# EAGLE design zigbee-dimmer2 (EAGLE 7.7.0)
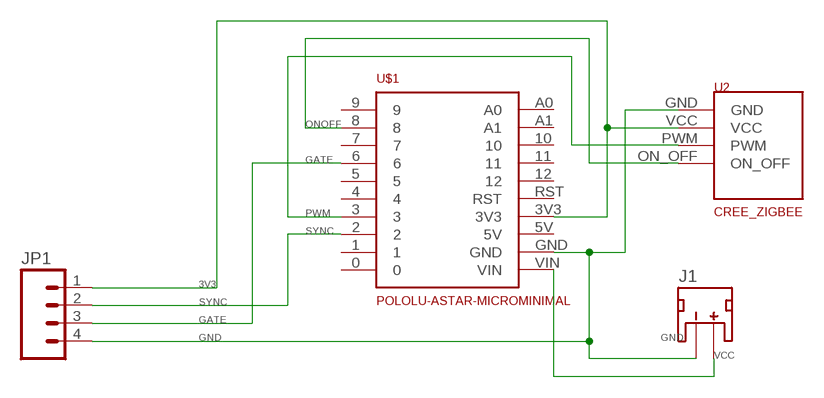
[diagram p0: schematic, sheet 1]

## Parts
J1  JST_2MM_MALE  [JST-2-SMD]
JP1  DIMMER_PINSSMD_180  [1X04-SMD]
U2  CREE_ZIGBEE  [CREE-ZIGBEE]
U$1  POLOLU-ASTAR-MICROMINIMAL  [POLOLU-ASTAR_MICRO_MIN]

## Nets
3V3: JP1.1 U2.VCC U$1.3V3
GATE: JP1.3 U$1.6
GND: J1.1(-) JP1.4 U2.GND U$1.GND
ONOFF: U2.ON_OFF U$1.8
PWM: U2.PWM U$1.3
SYNC: JP1.2 U$1.2
VCC: J1.2(+) U$1.VIN
Unconnected: J1.NC1(PAD1) J1.NC2(PAD2) U$1.0 U$1.1 U$1.4 U$1.5 U$1.7 U$1.9 U$1.10 U$1.11 U$1.12 U$1.A0 U$1.A1 U$1.RST

## Power pins joined to a net without a drawn wire
5V: U$1.5V

## Library data of the parts
J1 = SparkFun-Connectors:JST_2MM_MALE: Mates to single-cell LiPo batteries. CONN-11443 Now with smashable polarity marks!; BTM_NEG: -; BTM_POS: +; PROD_ID: CONN-11443; TOP_NEG: -; TOP_POS: +
JP1 = zigbee-dimmer-libs:DIMMER_PINS: Header 4 Standard 4-pin 0.1" header. Use with straight break away headers (SKU : PRT-00116), right angle break away headers (PRT-00553), swiss pins (PRT-00743), machine pins (PRT-00117), and female headers (PRT-00115). Molex polarized connector foot print use with SKU : PRT-08231 with associated crimp pins and housings. 1MM SMD Version SKU: PRT-10208
U2 = zigbee-dimmer-libs:CREE_ZIGBEE
U$1 = zigbee-dimmer-libs:POLOLU-ASTAR-MICRO

## Board
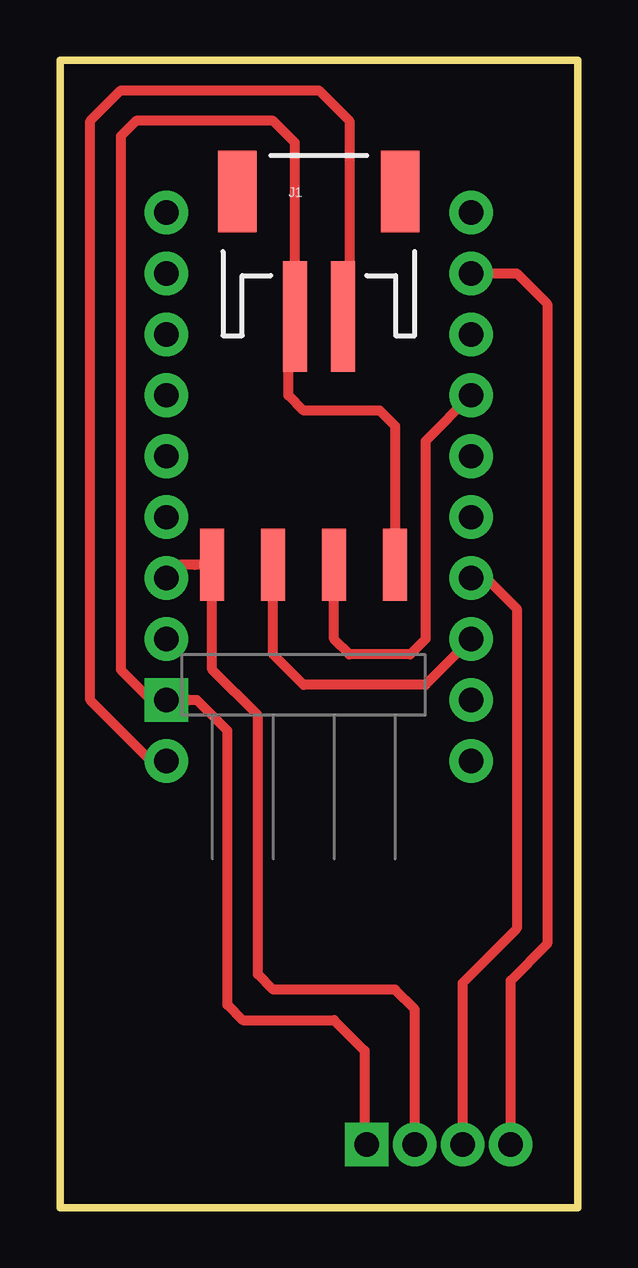
[diagram p1: board, top side]
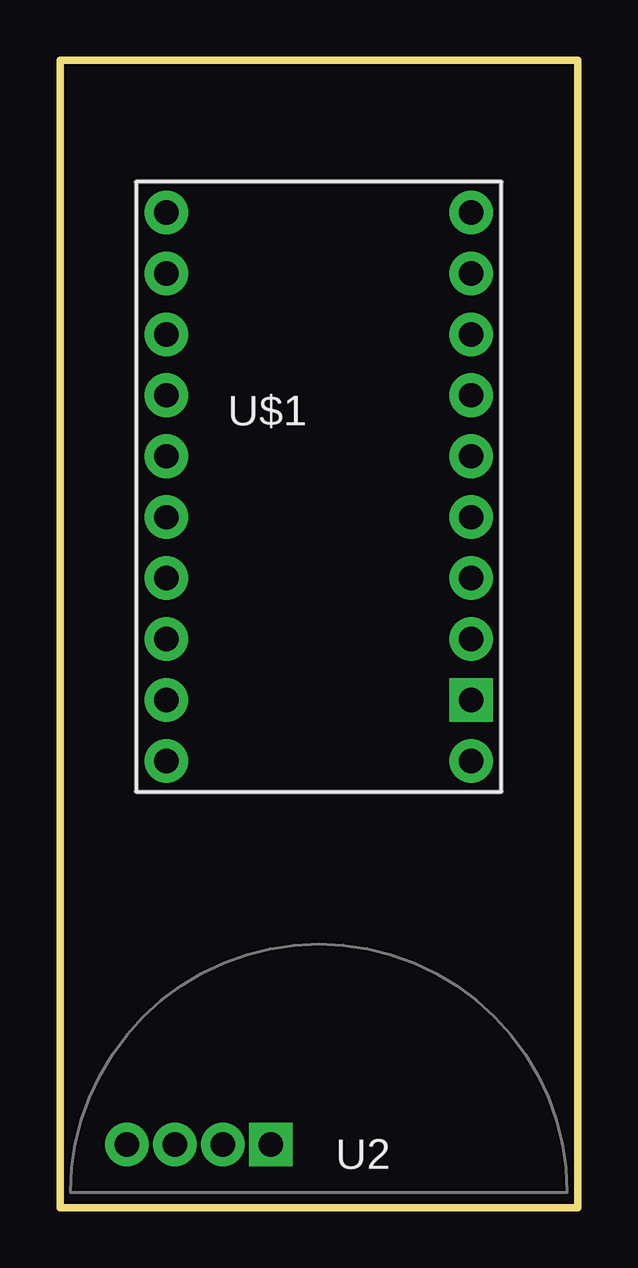
[diagram p2: board, bottom side, seen from below]

Size 21.59 x 47.81 mm. Coordinates in mm from the lower left corner, seen from the top.
Outline: 0,0 0,47.81 21.59,47.81 21.59,0 0,0
Copper layers 1+16: Top 0.035mm / dielectric 1.5mm / Bottom 0.035mm
Design rules "dru_16mils": minimum track width 10mil, minimum drill 0.8mm, track to track 16mil, track to pad 16mil, pad to pad 16mil, via to via 16mil, smd to smd 16mil, copper to edge 16mil, drill to drill 16mil, minimum pad ring 0.1mm, minimum via ring 0.8mm, stop-mask expansion 4mil, vias tented up to drill 0mil, thermal gap 1mm

### Footprints (pad centres in the part's own frame; a part is rotated, then mirrored left to right if it is on the bottom)
JST-2-SMD = smd 1 x 4.6: 1 -1,-3.7; 2 1,-3.7 | smd 1.6 x 3.4: NC1 -3.4,1.5; NC2 3.4,1.5
1X04-SMD = smd 1 x 3: 1 -3.81,5; 2 -1.27,5; 3 1.27,5; 4 3.81,5
CREE-ZIGBEE = drill 1.016 square: GND -2,2 | drill 1.016: ON_OFF -8,2; PWM -6,2; VCC -4,2
POLOLU-ASTAR_MICRO_MIN = drill 1.016: 0 -6.35,-11.43; 1 -6.35,-8.89; 2 -6.35,-6.35; 3 -6.35,-3.81; 3V3 6.35,-3.81; 4 -6.35,-1.27; 5 -6.35,1.27; 5V 6.35,-6.35; 6 -6.35,3.81; 7 -6.35,6.35; 8 -6.35,8.89; 9 -6.35,11.43; 10 6.35,6.35; 11 6.35,3.81; 12 6.35,1.27; A0 6.35,11.43; A1 6.35,8.89; RST 6.35,-1.27; VIN 6.35,-11.43 | drill 1.016 square: GND 6.35,-8.89

### Placement (x,y rotation side)
J1  10.79,40.83 0 top
JP1  10.16,21.78 0 top
U2  10.79,0.64 0 bottom
U$1  10.79,30.04 0 bottom

### Tracks (layer width: path | path; a pad name or v marks a point on that pad's centre or on a via)
3V3
  Top 0.406: JP1.1 5.63,26.78 | JP1.1 5,26.78 U$1.3V3 | U2.VCC 14.79,8.25 13.97,9.08 8.89,9.08 8.26,9.71 8.26,20.51 6.35,22.42 JP1.1
GATE
  Top 0.406: U$1.6 15.24,31.94 15.24,23.69 14.61,23.05 12.06,23.05 11.43,23.69 JP1.3
GND
  Top 0.406: JP1.4 13.97,32.57 13.34,33.21 10.16,33.21 9.53,33.84 9.53,36.86 J1.1 9.79,44.37 8.89,45.27 3.17,45.27 2.54,44.64 2.54,22.42 3.81,21.14 U$1.GND 5.71,21.14 6.99,19.88 6.99,8.45 7.62,7.81 11.43,7.81 12.7,6.54 12.7,2.73 U2.GND
ONOFF
  Top 0.406: U$1.8 19.05,38.92 20.32,37.66 20.32,10.98 18.8,9.46 U2.ON_OFF
PWM
  Top 0.406: U$1.3 17.78,26.23 19.05,24.96 19.05,11.62 16.8,9.37 U2.PWM
SYNC
  Top 0.406: U$1.2 15.24,21.78 10.16,21.78 8.89,23.05 JP1.2
VCC
  Top 0.406: U$1.VIN 3.81,18.61 1.27,21.14 1.27,45.27 2.54,46.54 10.79,46.54 12.06,45.27 12.06,37.4 J1.2